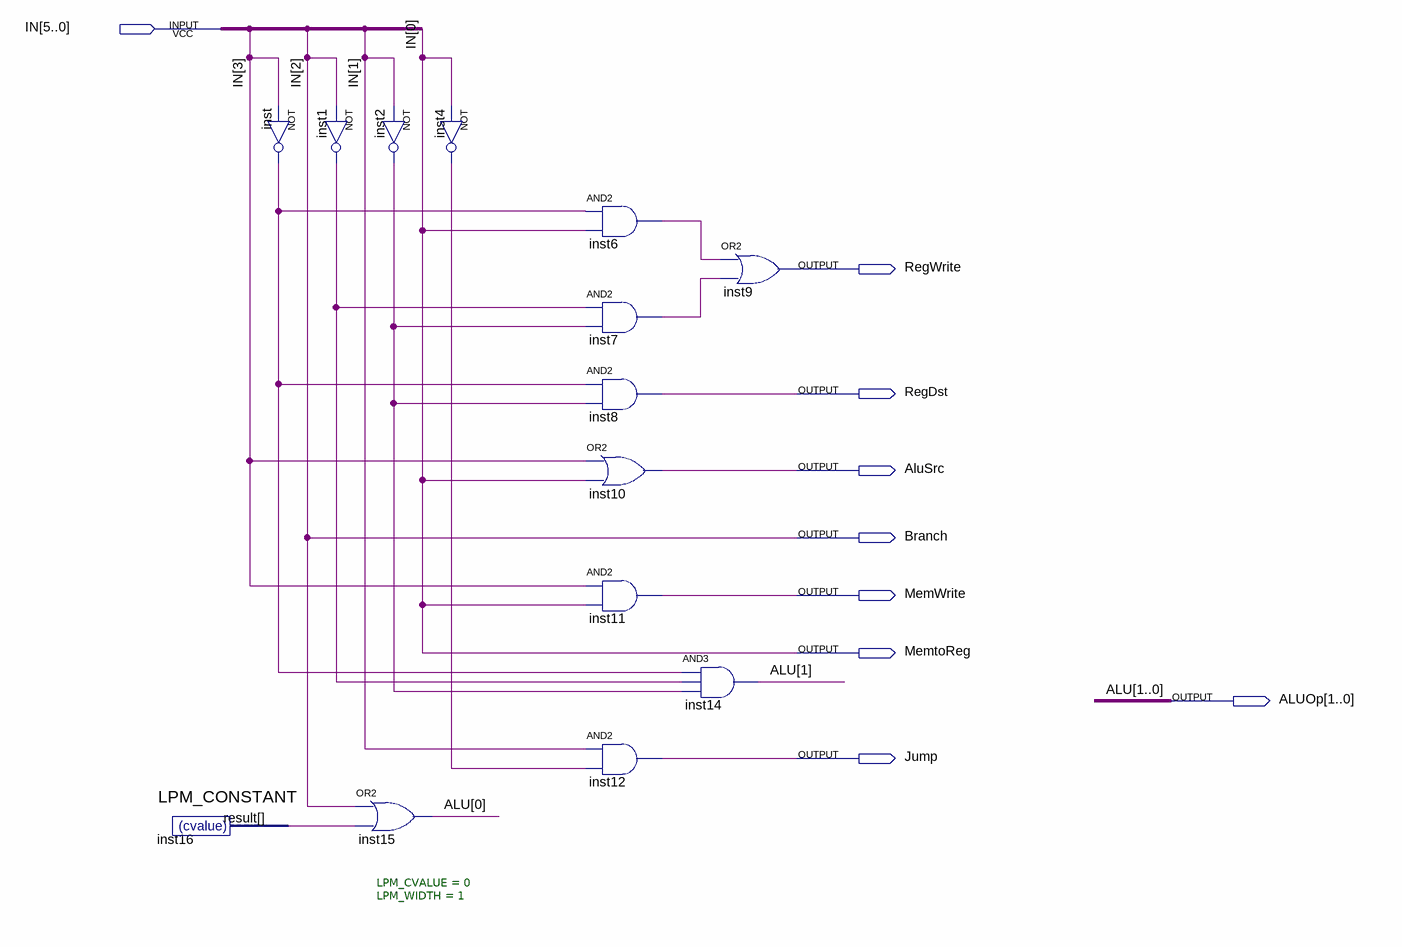
[diagram p0: schematic sheet]
// Quartus schematic maindecoder.bdf as structural Verilog: 14 symbols, 9 pins
module maindecoder (
  input  [5:0] IN,
  output RegWrite,
  output RegDst,
  output AluSrc,
  output Branch,
  output MemWrite,
  output MemtoReg,
  output [1:0] ALUOp,
  output Jump
);

  wire inst1_out, inst2_out, inst4_out, inst6_out, inst7_out, inst16_result, inst_out;

  LPM_CONSTANT #(.LPM_CVALUE(0), .LPM_WIDTH(1)) inst16 (.result(inst16_result));
  not inst (inst_out, IN[3]);
  not inst1 (inst1_out, IN[2]);
  not inst2 (inst2_out, IN[1]);
  or inst15 (ALUOp[0], IN[2], inst16_result);
  not inst4 (inst4_out, IN[0]);
  and inst6 (inst6_out, inst_out, IN[0]);
  and inst7 (inst7_out, inst1_out, inst2_out);
  and inst8 (RegDst, inst_out, inst2_out);
  or inst10 (AluSrc, IN[3], IN[0]);
  and inst11 (MemWrite, IN[3], IN[0]);
  and inst12 (Jump, IN[1], inst4_out);
  and inst14 (ALUOp[1], inst_out, inst1_out, inst2_out);
  or inst9 (RegWrite, inst6_out, inst7_out);

  assign Branch = IN[2];
  assign MemtoReg = IN[0];

  // Other names for the same wires on the sheet: ALU[1:0] = ALUOp
endmodule
